# EAGLE design rlyp-001 (EAGLE 9.6.2)
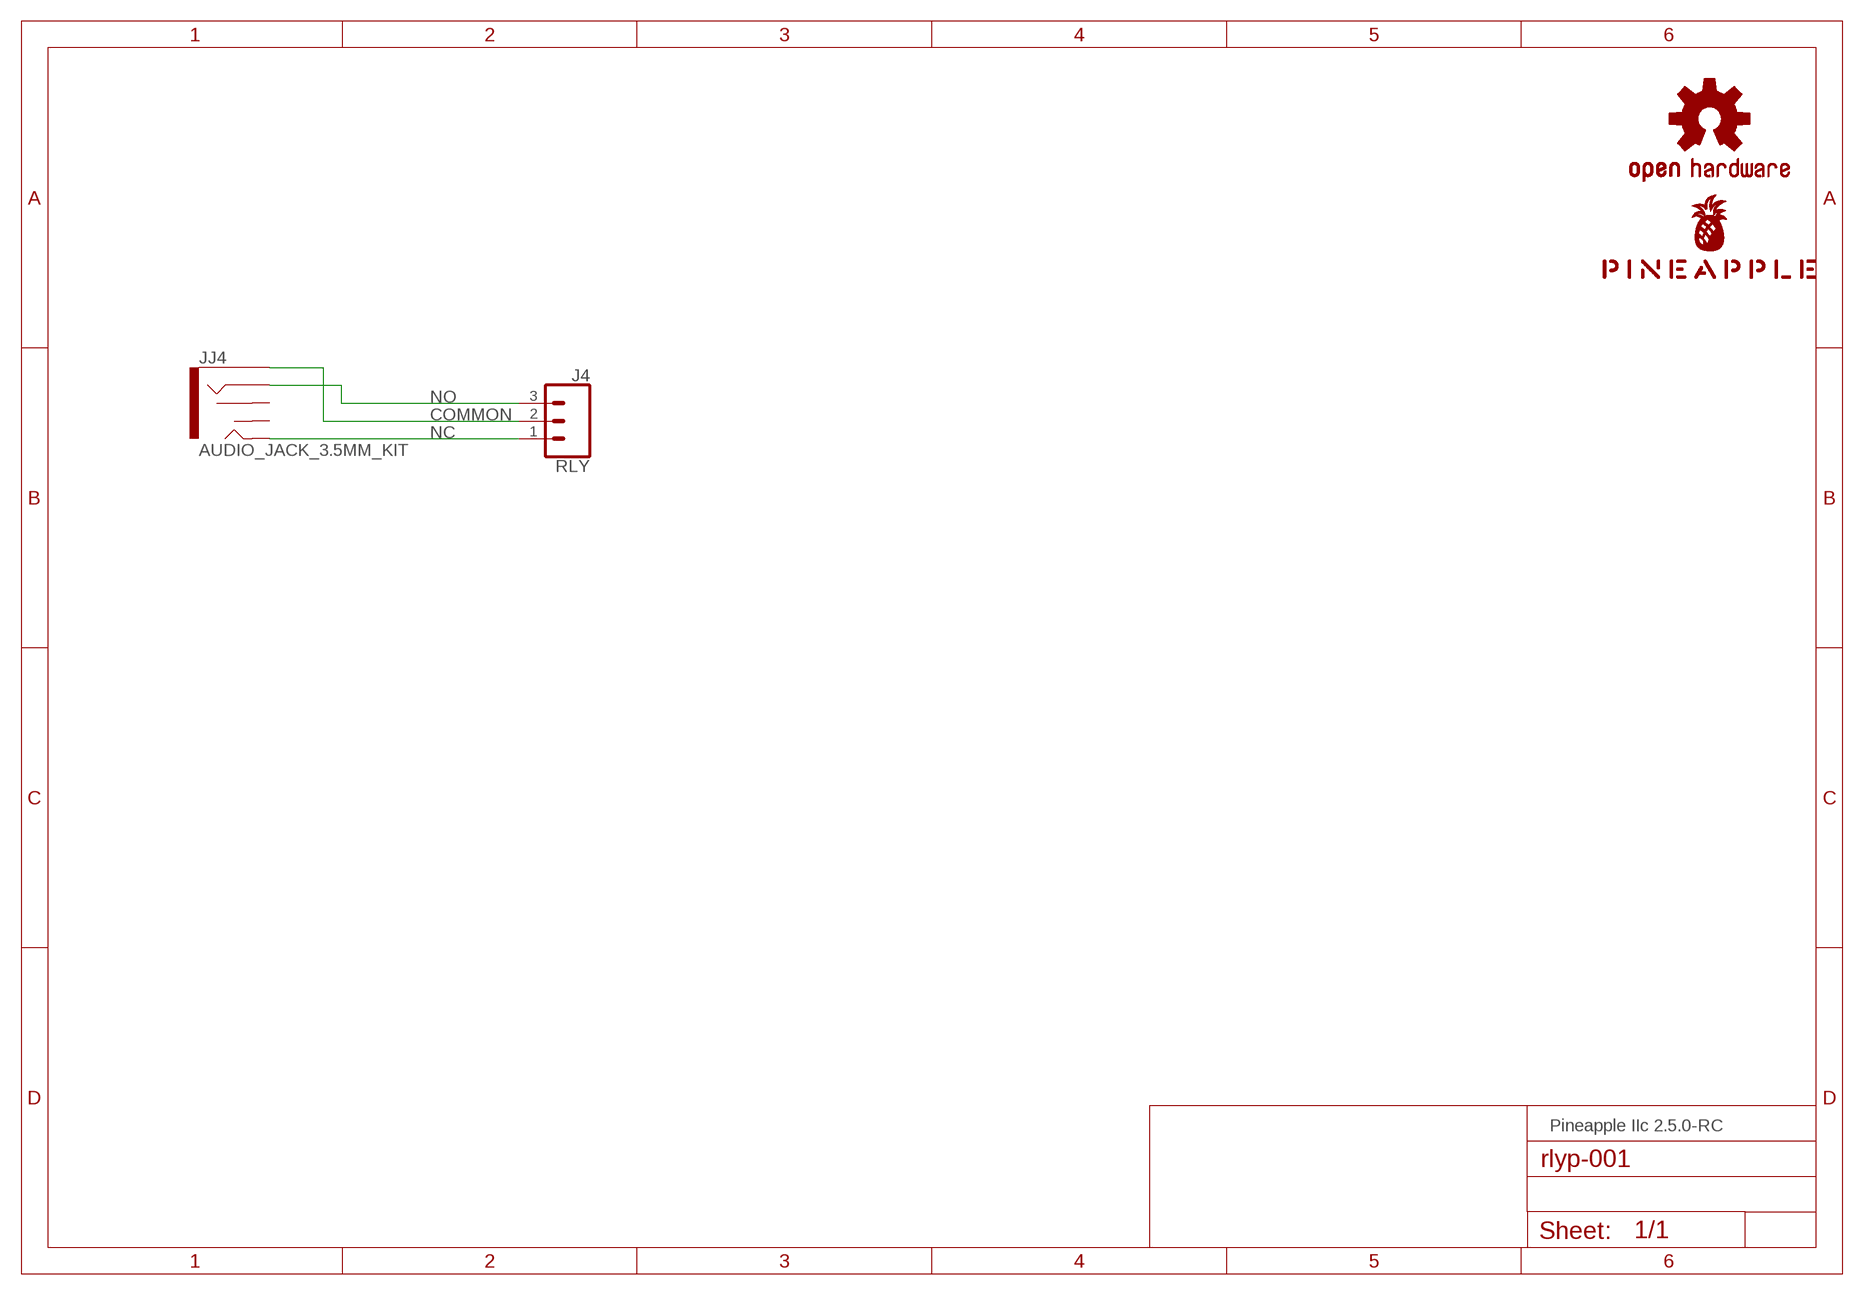
[diagram p0: schematic, sheet 1]

## Parts
J4  RLY  CONN_03JST-PTH-VERT  [JST-3-PTH-VERT]
JJ4  AUDIO_JACK_3.5MM_KIT  [AUDIO-JACK-KIT]
LOGO1  OSHW-LOGOS-COPPER  [OSHW-LOGO-S_COPPER]
U$1  PINEAPPLE450_SILK  [PINEAPPLE450_SILK]

## Nets
COMMON: J4.2 JJ4.SLEEVE
NC: J4.1 JJ4.TIP
NO: J4.3 JJ4.RING
Unconnected: JJ4.RSH JJ4.TSH

## Notes on the sheet
- Pineapple IIc 2.5.0-RC

## Library data of the parts
J4 = SparkFun-Connectors:CONN_03: Multi connection point. Often used as Generic Header-pin footprint for 0.1 inch spaced/style header connections On any of the 0.1 inch spaced packages, you can populate with these: Break Away Headers - Straight <https://www.sparkfun.com/products/116> (PRT-00116) Break Away Male Headers - Right Angle <https://www.sparkfun.com/products/553> (PRT-00553) Female Headers <https://www.sparkfun.com/products/115> (PRT-00115) Break Away Headers - Machine Pin <https://www.sparkfun.com/products/117> (PRT-00117) Break Away Female Headers - Swiss Machine Pin <https://www.sparkfun.com/products/743> (PRT-00743) Stackable Header - 3 Pin (Female, 0.1") <https://www.sparkfun.com/products/13875> (PRT-13875) For SCREWTERMINALS and SPRING TERMINALS visit here: Screw Terimnals on SparkFun.com <https://www.sparkfun.com/search/results?term=Screw+Terminals> (5mm/3.5mm/2.54mm spacing) This device is also useful as a general connection point to wire up your design to another part of your project. Our various solder wires solder well into these plated through hole pads. Hook-Up Wire - Assortment (Stranded, 22 AWG) <https://www.sparkfun.com/products/11375> (PRT-11375) Hook-Up Wire - Assortment (Solid Core, 22 AWG) <https://www.sparkfun.com/products/11367> (PRT-11367) View the entire wire category on our website here <https://www.sparkfun.com/categories/141> Special notes: Molex polarized connector foot print use with SKU : PRT-08232 with associated crimp pins and housings.; PROD_ID: CONN-13230
JJ4 = SparkFun-Connectors:AUDIO_JACK_3.5MM: Audio Jack 3.5mm variants of PTH and SMT stereo audio jack with bypass switches. SparkFun Products: SparkFun SparkPunk Sound Kit <[https://www.sparkfun.com/products/11177]> - PTH MP3 Trigger <https://www.sparkfun.com/products/13720> -3.5mm SMD SparkFun PicoBoard <https://www.sparkfun.com/products/11888>- 2.5mm SMD; PROD_ID: CONN-08774; SF_ID: PRT-08032
LOGO1 = SparkFun-Aesthetics:OSHW-LOGO: Open-Source Hardware (OSHW) Logo This logo indicates the piece of hardware it is found on incorporates a OSHW license and/or adheres to the definition of open source hardware found here: http://freedomdefined.org/OSHW
U$1 = pineapple:PINEAPPLE450_SILK

## Net classes
0 default: width 0.152 mm, drill 0.152 mm, clearance 0.152 mm
1 ground: width 0.305 mm, drill 0.152 mm, clearance 0.152 mm
2 power1: width 0.508 mm, drill 0.152 mm, clearance 0.152 mm
3 power2: width 0.61 mm, drill 0.152 mm, clearance 0.152 mm
4 analog: width 0.305 mm, drill 0.152 mm, clearance 0.152 mm
5 external: width 0.152 mm, drill 0.152 mm, clearance 0.152 mm

## Board
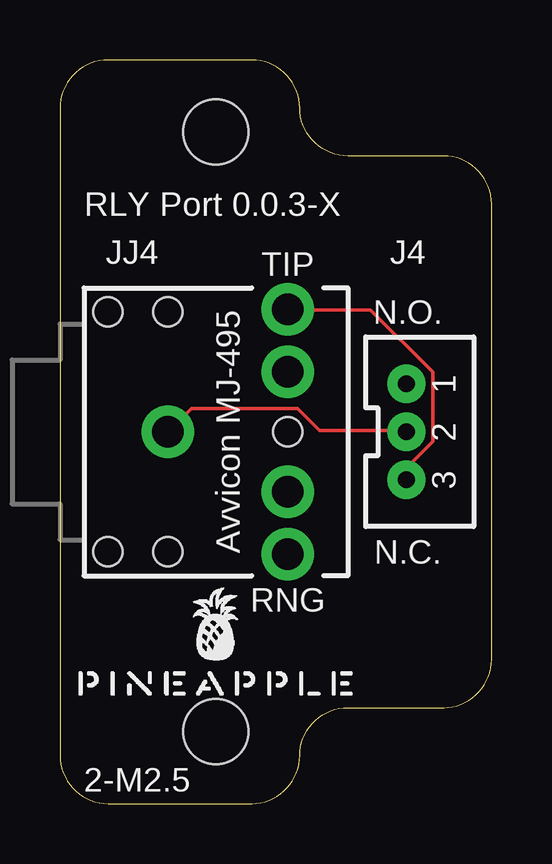
[diagram p1: board, top side]
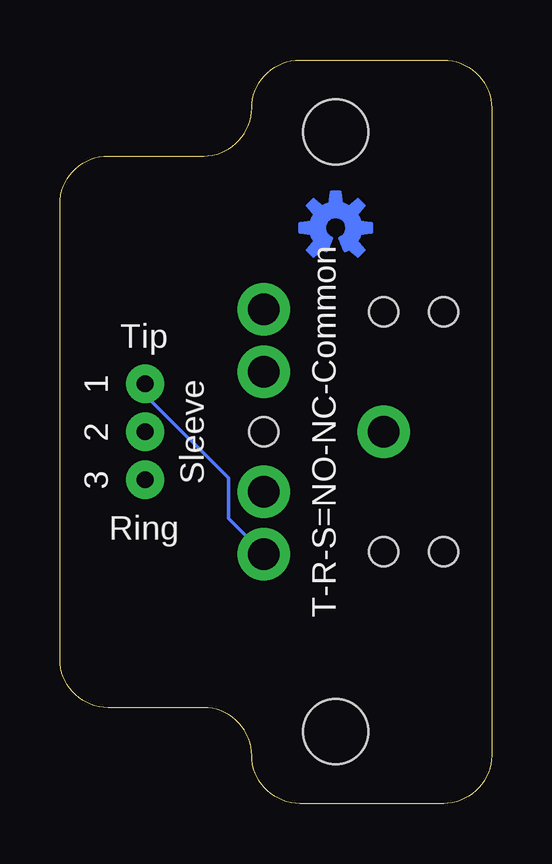
[diagram p2: board, bottom side, seen from below]

Size 18 x 31 mm. Coordinates in mm from the lower left corner, seen from the top.
Outline: 0,29 0,2 arc90 2,0 8,0 arc90 10,2 arc-90 12,4 16,4 arc90 18,6 18,25 arc90 16,27 12,27 arc-90 10,29 arc90 8,31 2,31 arc90 0,29
Copper layers (1*16): Top 0.035mm / dielectric 1.5mm / Bottom 0.035mm
Design rules "SeeedStudio_2layer_DRU_no_angle_20140221": minimum track width 6mil, minimum drill 12mil, track to track 6mil, track to pad 6mil, pad to pad 6mil, via to via 6mil, smd to smd 0mil, copper to edge 10mil, drill to drill 10mil, minimum pad ring 10mil, minimum via ring 6mil, stop-mask expansion 2mil, vias tented up to drill 100mil, thermal gap 10mil
Holes 2.7 mm at 6.5,3 6.5,28
tRestrict: area 4.5,1 to 8.5,5; area 4.5,26 to 8.5,30; area 0,0 to 1,31; area 0,30 to 10,31; area 9,26 to 10,31; area 9,26 to 18,27; area 17,4 to 18,27; area 9,4 to 18,5; area 9,0 to 10,5; area 0,0 to 10,1
bRestrict: area 0,0 to 10,1; area 17,4 to 18,27; area 0,30 to 10,31; area 0,0 to 1,31; area 4.5,1 to 8.5,5; area 4.5,26 to 8.5,30; area 9,26 to 18,27; area 9,4 to 18,5; area 9,0 to 10,5; area 9,26 to 10,31

### Footprints (pad centres in the part's own frame; a part is rotated, then mirrored left to right if it is on the bottom)
JST-3-PTH-VERT = drill 0.7 pad 1.6: 1 -2,-0.55; 2 0,-0.55; 3 2,-0.55
AUDIO-JACK-KIT = drill 1.3 pad 2.184: RING 5,5.1; RSH 5,2.5; SLEEVE 0,0; TIP 5,-5.1; TSH 5,-2.5 | hole 1.2: 0,5; -2.5,5; -2.5,-5; 0,-5; 5,0

### Placement (x,y rotation side)
J4  15,15.5 270 top
JJ4  4.5,15.5 0 top
LOGO1  6.5,24 0 bottom
U$1  6.5,4.5 0 top

### Tracks (layer width: path | path; a pad name or v marks a point on that pad's centre or on a via)
COMMON
  Top 0.152: J4.2 14.33,15.54 10.82,15.54 9.91,16.46 5.49,16.46 4.57,15.54 JJ4.SLEEVE
NC
  Bottom 0.152: J4.1 14.33,17.37 14.33,16.92 10.97,13.56 10.97,11.89 9.6,10.52 JJ4.TIP
NO
  Top 0.152: J4.3 14.48,13.56 14.48,14.02 15.54,15.09 15.54,17.98 12.95,20.57 9.6,20.57 JJ4.RING

### Text on the board
tNames: RLY Port 0.0.3-X | TIP | N.O. | 1 | Avvicon MJ-495 | 2 | 3 | N.C. | RNG | 2-M2.5
bNames: Tip | 1 | T-R-S=NO-NC-Common | Sleeve | 2 | 3 | Ring